# Altium schematic sheet circuito1.SchDoc
size A4; SheetNumber: 2; SheetTotal: 2
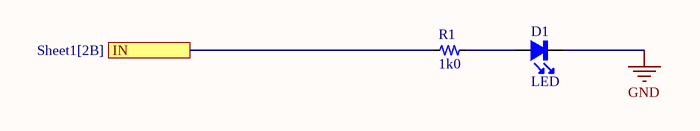
[diagram p0: circuito1.SchDoc]

## Parts
D1  LED  [LED-0805]
R1  1k0  [R2512]

## Ports
IN (see Sheet1[2B])

## Nets
GND: D1.1
IN: R1.1 ; port IN
NetD1_2: D1.2 R1.2

## Library data of the parts
D1 = LED: LED - Light-Emitting Diode; Manufacturer: *; Part number: *; Unit price: *; Value: LED
R1 = Resistor: Single resistor; Power: 0.125W; Manufacturer: *; Part number: *; Value: 1k0; Unit price: 0.1